# EAGLE design polarplotter rm12 v3 (EAGLE 5.07)
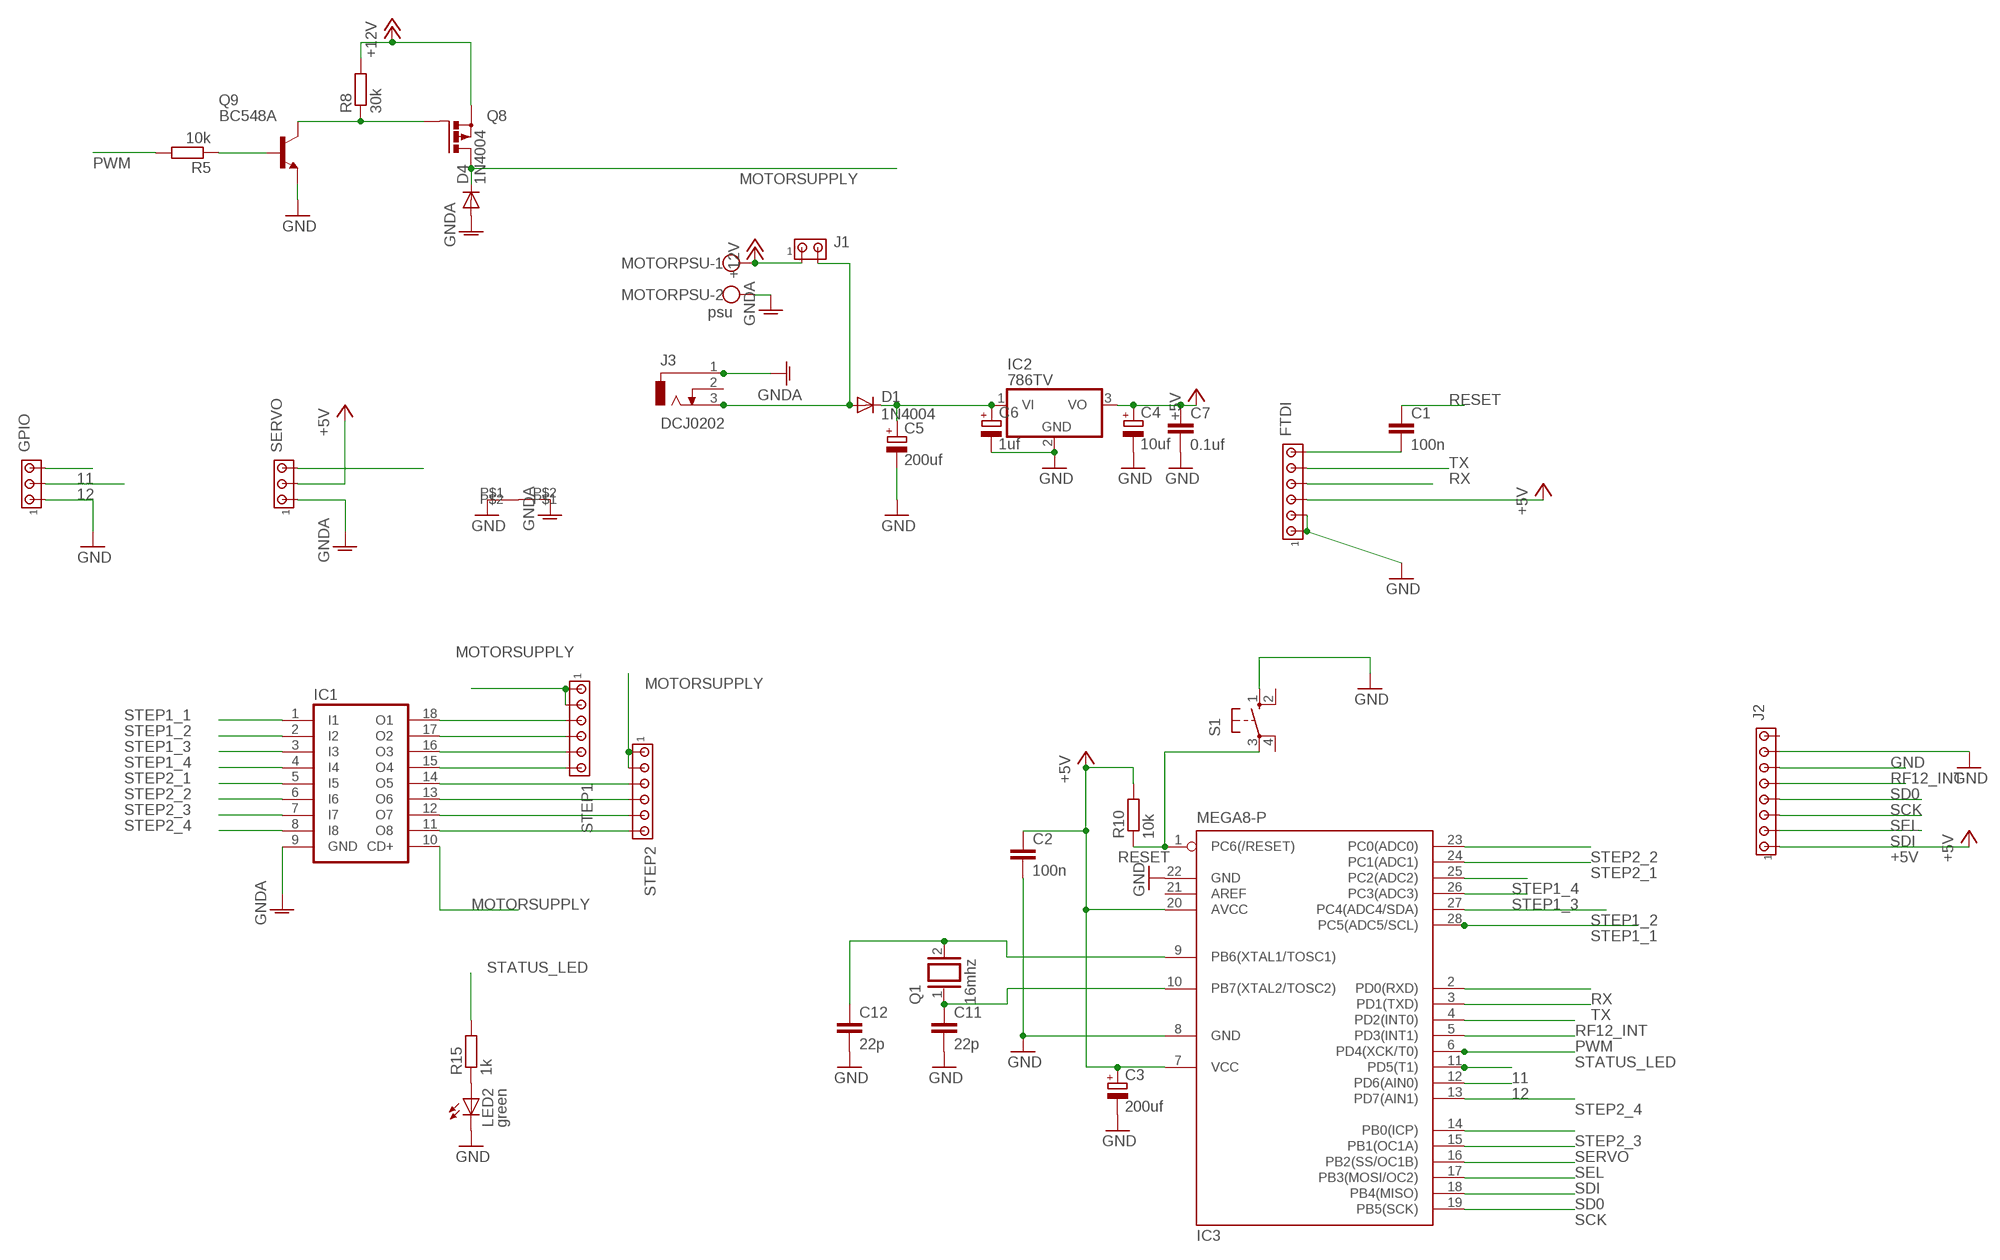
[diagram p0: schematic, sheet 1]

## Parts
C1  100n  C-EU050-025X075  [C050-025X075]
C2  100n  C-EU050-025X075  [C050-025X075]
C3  200uf  CPOL-EUE2-4  [E2-4]
C4  10uf  CPOL-EUE2-4  [E2-4]
C5  200uf  CPOL-EUE3.5-8  [E3,5-8]
C6  1uf  CPOL-EUE2-4  [E2-4]
C7  0.1uf  C-EU050-025X075  [C050-025X075]
C11  22p  C-EU050-025X075  [C050-025X075]
C12  22p  C-EU050-025X075  [C050-025X075]
D1  1N4004  [DO41-10]
D4  1N4004  [DO41-10]
FTDI  MTA06-100  [10X06MTA]
GPIO  MTA03-100  [10X03MTA]
IC1  ULN2803A  [DIL18]
IC2  786TV  [TO220V]
IC3  MEGA8-P  [DIL28-3]
J1  MTA02-100  [10X02MTA]
J2  MTA08-100  [10X08MTA]
J3  DCJ0202  [DCJ0202]
LED2  green  LED5MM  [LED5MM]
MOTORPSU  psu  W237-102  [W237-102]
Q1  16mhz  XTAL/S  [QS]
Q8  PMOSFET_PTO220BV  [TO220BV]
Q9  BC548A  [TO92-EBC]
R5  10k  R-EU_0204/7  [0204/7]
R8  30k  R-EU_0204/7  [0204/7]
R10  10k  R-EU_0204/7  [0204/7]
R15  1k  R-EU_0204/7  [0204/7]
S1  10-XX  [B3F-10XX]
SERVO  MTA03-100  [10X03MTA]
STEP1  MTA06-100  [10X06MTA]
STEP2  MTA06-100  [10X06MTA]
U$4  SHORT  [SHORT]

## Nets
11: GPIO.3 IC3.11(PD5(T1))
12: GPIO.2 IC3.12(PD6(AIN0))
+5V: C2.1 C3.+ C4.+ C7.1 FTDI.4 IC2.3(VO) IC3.7(VCC) IC3.20(AVCC) J2.1 R10.2 SERVO.2
+12V [power]: J1.1 MOTORPSU.1 Q8.S R8.2
GND: C2.2 C3.- C4.- C5.- C6.- C7.2 C11.2 C12.2 FTDI.5 FTDI.6 GPIO.1 IC2.2(GND) IC3.8(GND) IC3.22(GND) J2.7 LED2.K(C) Q9.E S1.1(S) U$4.P$1
GNDA [power]: D4.A IC1.9(GND) J3.1 MOTORPSU.2 SERVO.1 U$4.P$2
MOTORSUPPLY [power]: D4.C IC1.10(CD+) Q8.D STEP1.5 STEP1.6 STEP2.5 STEP2.6
N$1: IC1.18(O1) STEP1.4
N$2 [power]: D1.A J1.2 J3.3
N$4: IC1.17(O2) STEP1.3
N$5: C1.2 FTDI.1
N$6: IC1.16(O3) STEP1.2
N$7: IC1.15(O4) STEP1.1
N$8: IC1.14(O5) STEP2.4
N$9: IC1.13(O6) STEP2.3
N$10: C11.1 IC3.10(PB7(XTAL2/TOSC2)) Q1.1
N$11: C12.1 IC3.9(PB6(XTAL1/TOSC1)) Q1.2
N$12: IC1.12(O7) STEP2.2
N$13: IC1.11(O8) STEP2.1
N$15: LED2.A R15.1
N$17: Q8.G Q9.C R8.1
N$18: Q9.B R5.1
N$19: C5.+ C6.+ D1.C IC2.1(VI)
PWM: IC3.5(PD3(INT1)) R5.2
RESET: C1.1 IC3.1(PC6(/RESET)) R10.1 S1.3(P)
RF12_INT: IC3.4(PD2(INT0)) J2.6
RX: FTDI.3 IC3.2(PD0(RXD))
SCK: IC3.19(PB5(SCK)) J2.4
SD0: IC3.18(PB4(MISO)) J2.5
SDI: IC3.17(PB3(MOSI/OC2)) J2.2
SEL: IC3.16(PB2(SS/OC1B)) J2.3
SERVO: IC3.15(PB1(OC1A)) SERVO.3
STATUS_LED: IC3.6(PD4(XCK/T0)) R15.2
STEP1_1: IC1.1(I1) IC3.28(PC5(ADC5/SCL))
STEP1_2: IC1.2(I2) IC3.27(PC4(ADC4/SDA))
STEP1_3: IC1.3(I3) IC3.26(PC3(ADC3))
STEP1_4: IC1.4(I4) IC3.25(PC2(ADC2))
STEP2_1: IC1.5(I5) IC3.24(PC1(ADC1))
STEP2_2: IC1.6(I6) IC3.23(PC0(ADC0))
STEP2_3: IC1.7(I7) IC3.14(PB0(ICP))
STEP2_4: IC1.8(I8) IC3.13(PD7(AIN1))
TX: FTDI.2 IC3.3(PD1(TXD))
Unconnected: IC3.21(AREF) J2.8 J3.2 S1.2(S1) S1.4(P1)

## Library data of the parts
C1 C2 C7 C11 C12 = matt rcl:C-EU: CAPACITOR, European symbol
C3-C6 = matt rcl:CPOL-EU: POLARIZED CAPACITOR, European symbol
D1 D4 = matt diode:1N4004: DIODE general purpose rectifier, 1 A
FTDI STEP1 STEP2 = matt con-amp:MTA06-100: AMP connector
GPIO SERVO = matt con-amp:MTA03-100: AMP connector
IC1 = uln-udn:ULN2803A: DRIVER ARRAY
IC2 = linear:78*: Positive VOLTAGE REGULATOR Source: http://cache.national.com/ds/LM/LM78L05.pdf http://www.fairchildsemi.com/ds/LM/LM7805.pdf
IC3 = atmel:MEGA8-P: MICROCONTROLLER 8 Kbytes FLASH, 1 kbytes SRAM, 512 bytes EEPROM, USART, 4-channel 10 bit ADC, 2-channel 8 bit ADC Pin compatible with Atmega48, ATMega88, ATMega168 Source: avr.lbr
J1 = matt con-amp:MTA02-100: AMP connector
J2 = matt con-amp:MTA08-100: AMP connector
J3 = con-jack:DCJ0202: DC POWER JACK Source: DCJ0202.pdf
LED2 = matt led:LED: LED OSRAM: - CHIPLED LG R971, LG N971, LY N971, LG Q971, LY Q971, LO R971, LY R971 LH N974, LH R974 LS Q976, LO Q976, LY Q976 LO Q996 - Hyper CHIPLED LW Q18S LB Q993, LB Q99A, LB R99A - SideLED LS A670, LO A670, LY A670, LG A670, LP A670 LB A673, LV A673, LT A673, LW A673 LH A674 LY A675 LS A676, LA A676, LO A676, LY A676, LW A676 LS A679, LY A679, LG A679 - Hyper Micro SIDELED® LS Y876, LA Y876, LO Y876, LY Y876 LT Y87S - SmartLED LW L88C, LW L88S LB L89C, LB L89S, LG L890 LS L89K, LO L89K, LY L89K LS L896, LA L896, LO L896, LY L896 - TOPLED LS T670, LO T670, LY T670, LG T670, LP T670 LSG T670, LSP T670, LSY T670, LOP T670, LYG T670 LG T671, LOG T671, LSG T671 LB T673, LV T673, LT T673, LW T673 LH T674 LS T676, LA T676, LO T676, LY T676, LB T676, LH T676, LSB T676, LW T676 LB T67C, LV T67C, LT T67C, LS T67K, LO T67K, LY T67K, LW E67C LS E67B, LA E67B, LO E67B, LY E67B, LB E67C, LV E67C, LT E67C LW T67C LS T679, LY T679, LG T679 LS T770, LO T770, LY T770, LG T770, LP T770 LB T773, LV T773, LT T773, LW T773 LH T774 LS E675, LA E675, LY E675, LS T675 LS T776, LA T776, LO T776, LY T776, LB T776 LHGB T686 LT T68C, LB T68C - Hyper Mini TOPLED® LB M676 - Mini TOPLED Santana® LG M470 LS M47K, LO M47K, LY M47K Source: http://www.osram.convergy.de LUXEON: - LUMILED® LXK2-PW12-R00, LXK2-PW12-S00, LXK2-PW14-U00, LXK2-PW14-V00 LXK2-PM12-R00, LXK2-PM12-S00, LXK2-PM14-U00 LXK2-PE12-Q00, LXK2-PE12-R00, LXK2-PE12-S00, LXK2-PE14-T00, LXK2-PE14-U00 LXK2-PB12-K00, LXK2-PB12-L00, LXK2-PB12-M00, LXK2-PB14-N00, LXK2-PB14-P00, LXK2-PB14-Q00 LXK2-PR12-L00, LXK2-PR12-M00, LXK2-PR14-Q00, LXK2-PR14-R00 LXK2-PD12-Q00, LXK2-PD12-R00, LXK2-PD12-S00 LXK2-PH12-R00, LXK2-PH12-S00 LXK2-PL12-P00, LXK2-PL12-Q00, LXK2-PL12-R00 Source: www.luxeon.com KINGBRIGHT: KA-3528ASYC Source: www.kingbright.com
MOTORPSU = matt con-wago-500:W237-102: WAGO SCREW CLAMP
Q1 = matt special:XTAL/S: CRYSTAL
Q8 = transistor-power:PMOSFET_P: Power MOSFET P-Channel
Q9 = matt transistor-npn:BC548*: NPN Transistor
R5 R8 R10 R15 = matt rcl:R-EU_: RESISTOR, European symbol
S1 = switch-omron:10-XX: OMRON SWITCH
U$4 = matt:SHORT

## Net classes
1 power: width 3 mm

## Board
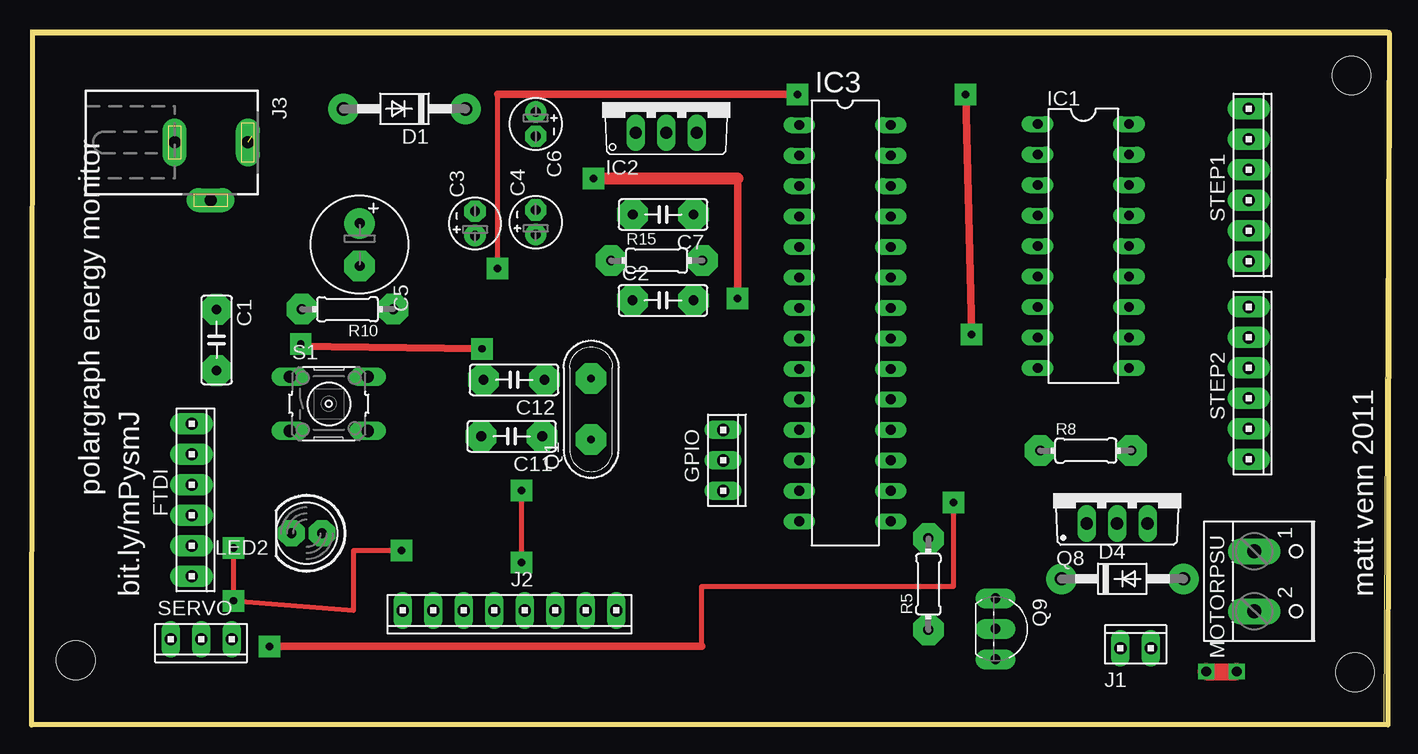
[diagram p1: board, top side]
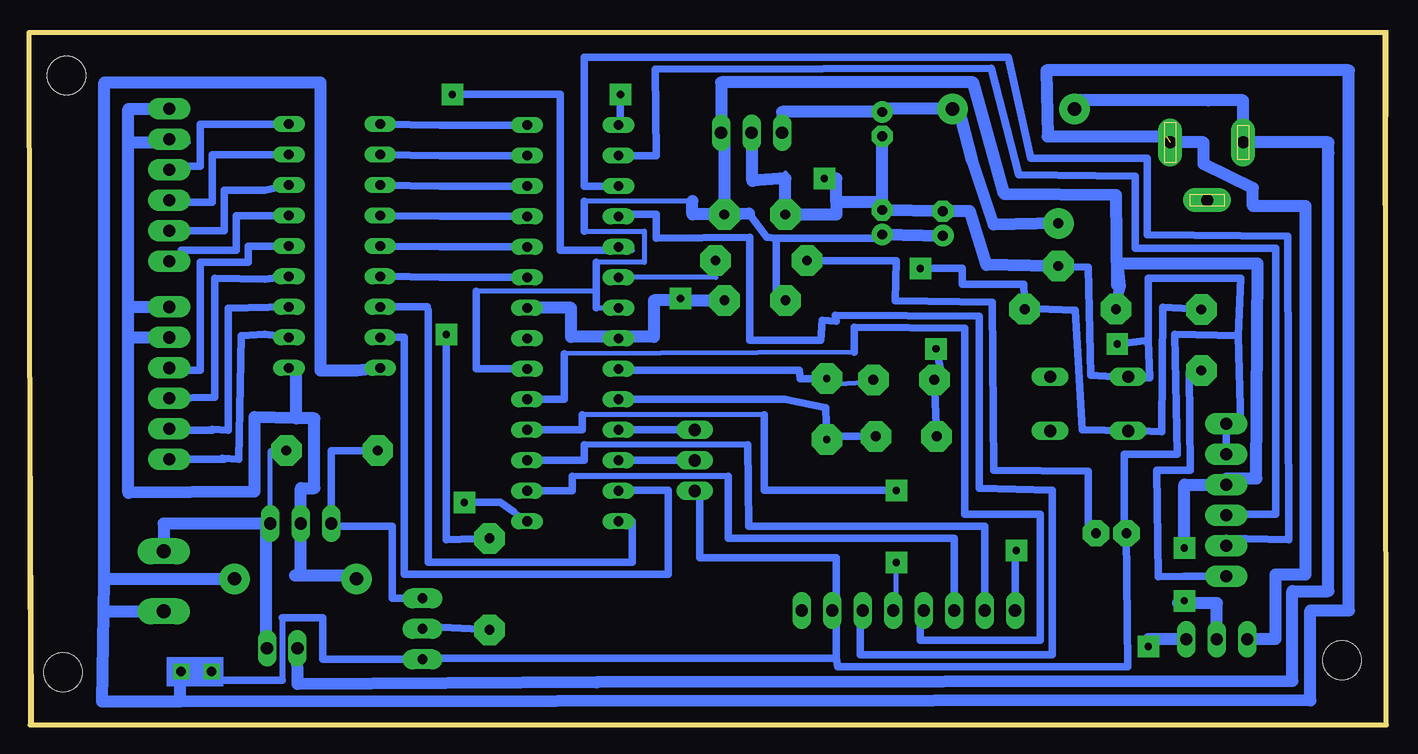
[diagram p2: board, bottom side, seen from below]

Size 113.16 x 57.83 mm. Coordinates in mm from the lower left corner, seen from the top.
Outline: 0.2,0 112.86,0 113.16,57.83 0,57.83 0.2,0
Copper layers (1*16): Top 0.035mm / dielectric 1.5mm / Bottom 0.035mm
Design rules "default": minimum track width 10mil, minimum drill 24mil, track to track 8mil, track to pad 8mil, pad to pad 8mil, via to via 8mil, smd to smd 8mil, copper to edge 40mil, drill to drill 8mil, minimum pad ring 10mil, minimum via ring 8mil, stop-mask expansion 4mil, vias tented up to drill 0mil, thermal gap 10mil
Holes 3.2 mm at 3.81,5.31 110.41,4.31 110.11,54.03
Milling: 4 lines

### Footprints (pad centres in the part's own frame; a part is rotated, then mirrored left to right if it is on the bottom)
C050-025X075 = drill 0.813 pad 2.54 octagon: 1 -2.54,0; 2 2.54,0
E2-4 = drill 0.813 pad 1.778 round: + -1.016,0 | drill 0.813 pad 1.778 octagon: - 1.016,0
E3,5-8 = drill 0.813 pad 2.54 round: + -1.778,0 | drill 0.813 pad 2.54 octagon: - 1.778,0
DO41-10 = drill 1.118 pad 2.54 round: A 5.08,0; C -5.08,0
10X06MTA = drill 1.016 pad 1.778 long: 1 6.35,0; 2 3.81,0; 3 1.27,0; 4 -1.27,0; 5 -3.81,0; 6 -6.35,0
10X03MTA = drill 1.016 long: 1 2.54,0; 2 0,0; 3 -2.54,0
DIL18 = drill 0.813 long: 1 -10.16,-3.81; 2 -7.62,-3.81; 3 -5.08,-3.81; 4 -2.54,-3.81; 5 0,-3.81; 6 2.54,-3.81; 7 5.08,-3.81; 8 7.62,-3.81; 9 10.16,-3.81; 10 10.16,3.81; 11 7.62,3.81; 12 5.08,3.81; 13 2.54,3.81; 14 0,3.81; 15 -2.54,3.81; 16 -5.08,3.81; 17 -7.62,3.81; 18 -10.16,3.81
TO220V = drill 1.016 long: 1 -2.54,-2.54; 2 0,-2.54; 3 2.54,-2.54
DIL28-3 = drill 0.813 long: 1 -16.51,-3.81; 2 -13.97,-3.81; 3 -11.43,-3.81; 4 -8.89,-3.81; 5 -6.35,-3.81; 6 -3.81,-3.81; 7 -1.27,-3.81; 8 1.27,-3.81; 9 3.81,-3.81; 10 6.35,-3.81; 11 8.89,-3.81; 12 11.43,-3.81; 13 13.97,-3.81; 14 16.51,-3.81; 15 16.51,3.81; 16 13.97,3.81; 17 11.43,3.81; 18 8.89,3.81; 19 6.35,3.81; 20 3.81,3.81; 21 1.27,3.81; 22 -1.27,3.81; 23 -3.81,3.81; 24 -6.35,3.81; 25 -8.89,3.81; 26 -11.43,3.81; 27 -13.97,3.81; 28 -16.51,3.81
10X02MTA = drill 1.016 long: 1 1.27,0; 2 -1.27,0
10X08MTA = drill 1.016 long: 1 8.89,0; 2 6.35,0; 3 3.81,0; 4 1.27,0; 5 -1.27,0; 6 -3.81,0; 7 -6.35,0; 8 -8.89,0
DCJ0202 = drill 1 pad 2 long: 1 0,3.1; 2 4.8,0; 3 0,-3
LED5MM = drill 0.813 pad 2.184 octagon: A -1.27,0; K 1.27,0
W237-102 = drill 1.194 pad 2.184 long: 1 -2.5,-1.27; 2 2.5,-1.27
QS = drill 0.61 pad 2.54 octagon: 1 -2.54,0; 2 2.54,0
TO220BV = drill 1.016 long: D 0,-2.54; G -2.54,-2.54; S 2.54,-2.54
TO92-EBC = drill 0.813 pad 1.676 long: B 0,-1.27; C -2.54,-1.27; E 2.54,-1.27
0204/7 = drill 0.813 pad 2.54 octagon: 1 -3.81,0; 2 3.81,0
B3F-10XX = drill 1.016 long: 1 -3.251,2.261; 2 3.251,2.261; 3 -3.251,-2.261; 4 3.251,-2.261
SHORT = drill 0.8 square: P$1 -2.54,0; P$2 0,0

### Placement (x,y rotation side)
C1  15.55,32 270 top
C2  52.75,35.3 0 top
C3  37.09,41.71 90 top
C4  42.14,41.81 90 top
C5  27.47,39.94 270 top
C6  42.14,49.99 270 top
C7  52.76,42.45 180 top
C11  40.14,23.97 180 top
C12  40.34,28.68 180 top
D1  31.21,51.26 180 top
D4  91.03,12.1 0 top
FTDI  13.47,18.67 270 top
GPIO  57.76,21.96 270 top
IC1  87.78,39.83 270 top
IC2  53.03,51.8 0 top
IC3  67.92,33.4 270 top
J1  92.14,6.31 0 top
J2  39.96,9.46 180 top
J3  15.06,48.46 270 top
LED2  23.06,15.89 180 top
MOTORPSU  103.29,11.89 270 top
Q1  46.76,26.24 90 top
Q8  90.59,19.24 0 top
Q9  81.72,7.93 270 top
R5  74.86,11.66 90 top
R8  87.99,22.78 0 top
R10  26.46,34.56 180 top
R15  52.22,38.62 0 top
S1  24.9,26.68 0 top
SERVO  14.26,7.06 180 top
STEP1  101.56,44.91 270 top
STEP2  101.56,28.4 270 top
U$4  100.56,4.36 0 top

### Tracks (layer width: path | path; a pad name or v marks a point on that pad's centre or on a via)
11
  Bottom 0.61: GPIO.3 IC3.11
12
  Bottom 0.61: GPIO.2 IC3.12
+5V  (via drill 0.6 pad 1.78)
  Top 0.406: v16.96,14.66 v16.96,10.26 26.96,9.46 26.96,14.46 v30.96,14.46
  Bottom 0.406: 10.96,20.46 10.76,20.56 | FTDI.4 13.47,20.46 | IC2.3 55.3,49.26 | 50.96,34.8 C2.1 | 42.14,40.46 C4.+ | R10.2 22.06,36.46 22.26,38.36 | 65.96,34.67 IC3.7 | 65.96,38.46 61.96,38.46 61.96,41.06 66.96,41.06 | 57.96,43.56 66.96,43.56 | C7.1 | v30.96,14.46 31.07,14.46 | 65.96,36.06 75.96,36.06 | 17.48,10.06 17.48,10.22 16.96,10.22 v16.96,10.26
  Bottom 0.61: 50.96,40.46 50.96,34.8 | 50.96,40.46 42.14,40.46 | 53.26,42.55 51.76,40.56 50.96,40.46 | 65.96,38.46 65.96,36.06 65.96,34.67 | 66.96,43.56 66.96,41.06 | R10.2 22.56,36.56 | 31.07,14.46 J2.1 | IC3.20 75.96,29.59 75.96,36.06
  Bottom 1.016: 13.47,20.46 10.96,20.46 10.86,38.36 22.26,38.36 | 55.3,49.26 C7.1 53.26,42.55 | C4.+ C3.+ | 57.96,43.56 57.96,42.46 C7.1 | 22.56,36.56 22.66,44.06 31.96,44.16 34.56,53.46 55.57,53.46 IC2.3 | FTDI.4 16.96,19.94 v16.96,14.66 | SERVO.2 14.26,10.06 17.48,10.06
+12V
  Bottom 0.406: R8.2 93.13,22.78 Q8.S
  Bottom 1.016: MOTORPSU.1 102.02,16.7 Q8.S 93.13,16.26 93.46,16.26 93.46,6.31 J1.1
GND  (via drill 0.6 pad 1.78)
  Top 0.406: v22.56,31.66 21.96,31.46
  Top 0.61: 21.96,31.46 v37.66,31.26 | 58.96,45.46 v58.96,35.46
  Top 1.016: v46.96,45.46 58.96,45.46
  Bottom 0.406: 45.96,9.46 J2.7 | 52.96,49.06 IC2.2 | C4.- 42.14,43.46 | 27.97,38.16 C5.- | 21.55,28.86 S1.1 | LED2.K 21.96,15.89 | 80.45,5.46 Q9.E | 50.22,45.46 50.22,45.92 | v58.96,35.46 58.96,35.3
  Bottom 0.5: 64.21,32.26 IC3.8 | 92.16,8.86 92.16,3.66 | 98.02,3.66 U$4.P$1
  Bottom 0.61: C11.2 C12.2 37.16,28.88 v37.66,31.26 | 45.96,5.46 45.96,9.46 45.96,13.86 57.36,13.86 57.36,19.42 GPIO.1 | LED2.K 21.69,4.76 45.86,4.76 45.96,5.46 | FTDI.5 FTDI.6 12.26,24.92 12.46,32.36 | 27.97,38.16 24.96,38.06 24.76,29.06 21.55,28.86 19.86,28.86 19.96,31.96 | 12.46,32.36 12.26,37.16 19.96,37.16 19.96,31.96 | 21.96,15.89 21.96,22.46 17.56,22.46 17.76,32.46 12.46,32.36 | 45.96,5.46 80.45,5.46 | 19.96,31.96 v22.56,31.66 | Q9.E 88.76,5.39 88.76,8.86 92.16,8.86 | 92.16,3.66 98.02,3.66
  Bottom 1.016: IC3.22 68.06,34.67 68.06,32.26 64.21,32.26 61.16,32.26 61.16,35.3 58.96,35.3 C2.2 | 52.96,49.06 52.96,45.26 50.22,45.46 C7.2 45.96,42.45 45.96,43.46 | 42.14,43.46 45.96,43.46 | 27.97,38.16 33.46,38.26 34.86,42.73 C3.- C4.- C6.- | v46.96,45.46 45.96,45.46 45.96,43.46
GNDA  (1 unrouted)
  Bottom 0.5: 100.66,4.36 | 100.66,4.36 100.66,4.16 100.36,4.16 100.36,4.56 100.86,4.56 100.86,4.46
  Bottom 1: 28.36,48.96 18.46,48.96 | 6.86,43.16 11.26,43.16 11.26,44.66 15.36,46.66 15.36,48.46 J3.1
  Bottom 1.016: IC1.9 85.97,29.46 88.96,29.46 88.96,53.46 106.96,53.46 106.96,12.1 | 28.36,48.96 28.46,54.46 3.26,54.46 3.26,9.46 6.46,9.46 6.46,1.96 100.66,1.87 | 100.66,1.87 107.16,1.86 107.02,9.27 | 106.96,12.1 D4.A | 107.02,9.27 106.96,12.1 | SERVO.1 9.36,7.06 9.36,12.46 6.86,12.46 6.86,43.16 | MOTORPSU.2 107.02,9.39 107.02,9.27 | U$4.P$2 100.66,4.36 100.66,1.87
MOTORSUPPLY
  Bottom 0.406: 99.96,48.46 100.56,48.46 STEP1.5 | 90.96,29.67 IC1.10
  Bottom 0.61: 91.06,12.36 90.59,12.36
  Bottom 1.016: STEP1.6 104.96,51.26 104.96,48.46 | 104.96,48.46 100.56,48.46 | 104.96,34.75 STEP2.6 | 104.96,34.75 104.96,48.46 | 104.96,32.21 104.96,34.75 | 104.96,32.21 STEP2.5 | 104.96,32.21 104.96,19.26 94.46,19.36 94.46,25.56 90.96,25.46 | 90.96,25.46 90.96,29.67 | 91.06,12.36 85.95,12.36 D4.C | 90.96,25.46 89.46,25.46 89.46,19.66 90.59,19.66 Q8.D 90.59,12.36
N$1
  Bottom 0.406: 100.56,46.46 STEP1.4
  Bottom 0.61: IC1.18 98.96,49.99 98.96,46.46 100.56,46.46
N$2
  Bottom 0.406: 26.13,51.96 D1.A
  Bottom 1: 4.96,47.56 4.96,48.46 J3.3 12.06,51.96 14.96,51.96
  Bottom 1.016: J1.2 90.86,3.31 65.96,3.46 7.96,3.56 7.96,11.06 4.96,11.06 4.96,47.56 | 14.96,51.96 26.13,51.96
N$4
  Bottom 0.406: 100.56,43.46 STEP1.3
  Bottom 0.61: IC1.17 97.96,47.45 97.96,43.46 100.56,43.46
N$5
  Bottom 0.406: 15.35,29.46 C1.2
  Bottom 0.61: FTDI.1 16.96,12.32 19.16,12.26 19.26,21.16 16.46,21.16 16.56,29.36 15.35,29.46
N$6
  Bottom 0.61: STEP1.2 96.96,41.1 96.96,44.46 93.59,44.46 IC1.16
N$7
  Bottom 0.406: 100.56,39.46 STEP1.1
  Bottom 0.61: IC1.15 95.96,42.37 95.96,39.46 100.56,39.46
N$8
  Bottom 0.406: 100.56,29.46 STEP2.4
  Bottom 0.61: IC1.14 94.96,39.83 94.96,38.46 98.96,38.46 98.96,29.46 100.56,29.46
N$9
  Bottom 0.61: STEP2.3 97.76,27.23 97.76,37.16 93.59,37.06 IC1.13
N$10
  Bottom 0.406: 56.06,27.06 55.96,27.05 | 50.26,27.06 50.16,27.06 | 46.76,23.97 Q1.1
  Bottom 0.61: 55.96,27.05 IC3.10 | 56.06,27.06 50.26,27.06 46.86,26.36 Q1.1 | C11.1 46.76,23.97
N$11
  Bottom 0.406: 64.11,29.46 IC3.9 | C12.1 42.86,28.48 46.56,28.26 | 46.76,28.46 Q1.2
  Bottom 0.61: Q1.2 48.96,28.78 49.06,29.46 64.11,29.46 | 46.56,28.26 46.76,28.46
N$12
  Bottom 0.406: 97.96,24.46 97.96,24.56 | 100.56,24.46 STEP2.2
  Bottom 0.61: IC1.12 96.66,34.65 96.66,24.46 97.96,24.56 | 97.96,24.46 100.56,24.46
N$13
  Bottom 0.406: 97.16,22.16 96.96,22.05
  Bottom 0.61: 96.96,22.05 STEP2.1 | 97.16,22.16 95.76,22.06 95.56,32.36 93.59,32.46 IC1.11
N$15
  Bottom 0.406: 24.96,15.46 24.33,15.46 LED2.A
  Bottom 0.61: R15.1 40.96,38.62 41.06,35.26 32.96,35.16 32.86,21.16 24.96,21.06 24.96,15.46
N$17
  Bottom 0.406: 88.05,16.46 Q8.G
  Bottom 0.61: R8.1 88.05,22.78 Q8.G | Q9.C 82.96,10.47 82.96,16.46 88.05,16.46
N$18
  Bottom 0.406: 80.45,8.16 Q9.B
  Bottom 0.61: R5.1 80.45,8.16
N$19
  Bottom 0.406: 41.96,51.26 41.96,50.46 42.14,50.46 C6.+ | 35.79,51.46 D1.C
  Bottom 1.016: D1.C 41.96,51.26 | C6.+ 50.49,51.01 IC2.1 | C5.+ 32.86,41.62 34.66,46.96 35.79,51.46
PWM  (via drill 0.6 pad 1.78)
  Top 0.61: v78.46,32.46 v77.96,52.46
  Bottom 0.406: 62.96,39.46 64.11,39.46 IC3.5
  Bottom 0.61: R5.2 78.46,15.37 v78.46,32.46 | v77.96,52.46 68.96,52.46 68.96,39.46 64.11,39.46
RESET  (via drill 0.6 pad 1.78)
  Top 0.406: v38.96,37.96 38.96,52.46
  Top 0.61: 38.96,52.46 v63.96,52.46
  Bottom 0.406: 21.75,24.46 S1.3 | 30.47,34.66 R10.1 | 63.96,49.91 IC3.1
  Bottom 0.61: C1.1 18.76,34.74 18.86,24.36 21.75,24.46 | S1.3 25.46,24.52 26.06,34.46 30.47,34.66 | v63.96,52.46 63.96,49.91 | v38.96,37.96 35.47,37.96 35.47,36.66 30.36,36.66 R10.1
RF12_INT
  Bottom 0.406: 43.96,9.46 J2.6 | 64.11,42.46 IC3.4
  Bottom 0.61: 43.96,9.46 43.96,5.76 27.96,5.76 27.96,19.46 34.06,19.66 34.06,33.96 46.06,34.06 45.96,33.56 47.16,33.66 47.26,31.96 53.16,31.96 53.16,40.56 60.96,40.46 60.96,42.46 64.11,42.46
RX
  Bottom 0.406: 13.47,17.46 FTDI.3
  Bottom 0.61: IC3.2 60.96,47.37 61.06,54.56 33.06,54.66 30.76,45.76 21.06,45.66 21.06,39.66 9.36,39.66 9.36,17.46 13.47,17.46
SCK
  Bottom 0.406: 38.96,9.46 J2.4 | 44.46,30.96 68.66,30.86 | 71.63,27.06 IC3.19
  Bottom 0.61: 38.96,9.46 38.96,6.96 28.96,6.96 28.96,17.46 35.26,17.46 35.26,32.96 44.46,33.06 44.46,30.96 | 68.66,30.86 68.66,27.06 71.63,27.06
SD0  (via drill 0.6 pad 1.78)
  Top 0.406: v40.96,13.46 v40.96,19.46
  Bottom 0.406: 51.96,25.76 67.16,25.76 | J2.5 40.96,9.46 v40.96,13.46
  Bottom 0.61: IC3.18 67.16,24.51 67.16,25.76 | 51.96,25.76 51.96,19.46 v40.96,19.46
SDI
  Bottom 0.5: 53.36,23.26 66.96,23.26
  Bottom 0.61: IC3.17 66.96,21.97 66.96,23.26 | 53.36,23.26 53.26,16.46 33.61,16.46 J2.2
SEL
  Bottom 0.5: 54.96,20.66 67.96,20.66
  Bottom 0.61: IC3.16 67.96,19.43 67.96,20.66 | 54.96,20.66 54.96,15.46 36.15,15.46 J2.3
SERVO  (via drill 0.6 pad 1.78)
  Top 0.406: 55.96,6.46 55.96,11.46 76.96,11.46 v76.96,18.46
  Top 0.61: v19.96,6.46 55.96,6.46
  Bottom 0.406: 19.96,7.06 v19.96,6.46
  Bottom 0.5: 72.86,17.69 IC3.15
  Bottom 0.61: 72.86,17.69 73.96,18.46 v76.96,18.46
  Bottom 1.016: SERVO.3 19.96,7.06
STATUS_LED
  Bottom 0.406: R15.2 56.01,37.22 IC3.6
STEP1_1
  Bottom 0.61: IC3.28 78.97,49.91 IC1.1
STEP1_2
  Bottom 0.61: IC3.27 78.97,47.37 IC1.2
STEP1_3
  Bottom 0.61: IC3.26 78.97,44.83 IC1.3
STEP1_4
  Bottom 0.61: IC3.25 78.97,42.29 IC1.4
STEP2_1
  Bottom 0.61: IC3.24 78.97,39.75 IC1.5
STEP2_2
  Bottom 0.61: IC3.23 78.97,37.21 IC1.6
STEP2_3
  Bottom 0.5: 62.96,16.89 IC3.14 | 79.96,34.46 80.07,34.76
  Bottom 0.61: 62.96,16.89 62.96,13.46 79.96,13.46 79.96,34.46 | 80.07,34.76 IC1.7
STEP2_4
  Bottom 0.5: 64.11,19.46 IC3.13
  Bottom 0.61: IC1.8 81.96,32.21 81.96,12.46 59.96,12.46 59.96,19.46 64.11,19.46
TX
  Bottom 0.406: 13.47,15.46 FTDI.2
  Bottom 0.61: IC3.3 66.96,44.83 66.96,55.56 31.66,55.56 29.76,47.16 20.06,47.16 20.06,40.76 8.36,40.66 8.26,15.36 13.47,15.46
(copper drawn outside any net)
  shapes: Bottom area x1

### Text on the board
tPlace: polargraph energy monitor | bit.ly/mPysmJ | matt venn 2011